# Altium schematic sheet Peripheral.SchDoc
size A3
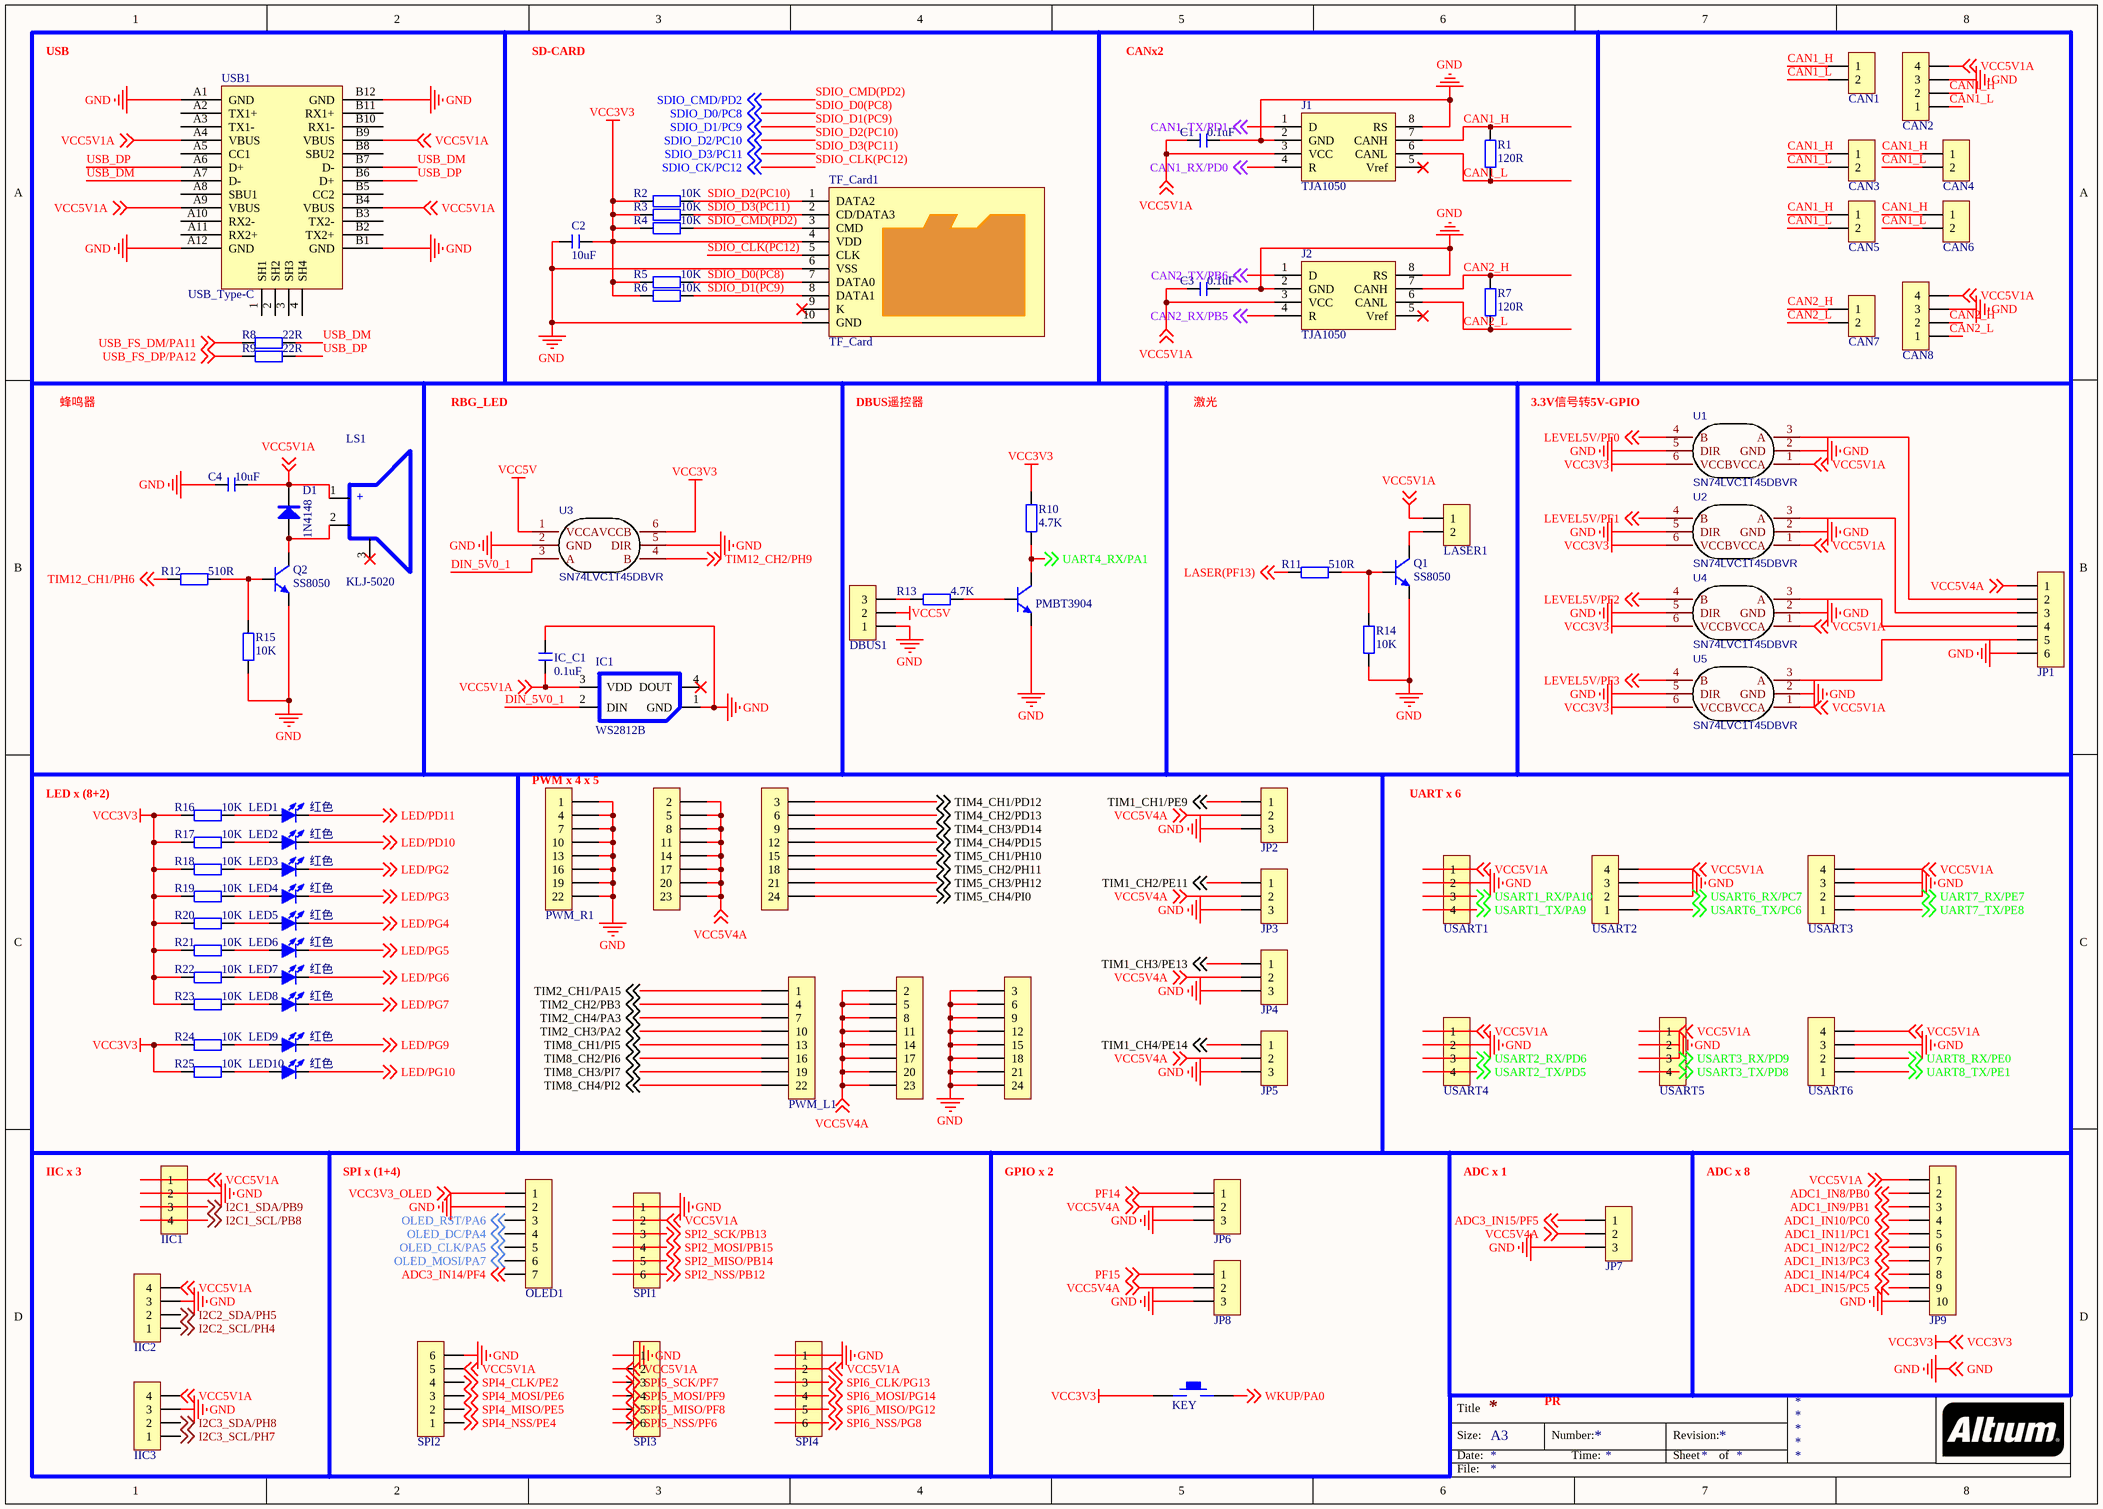
[diagram p0: Peripheral.SchDoc]

## Parts
C1  0.1uF  [C 0402_L]
C2  10uF  [C 0402_L]
C3  0.1uF  [C 0402_L]
C4  10uF  [C 0402_L]
CAN1  HDR-1X2  [MX 1.25-LS-2P]  (value not drawn)
CAN2  HDR-1X4  [MX 1.25-WS-4P]  (value not drawn)
CAN3  HDR-1X2  [MX 1.25-LS-2P]  (value not drawn)
CAN4  HDR-1X2  [MX 1.25-LS-2P]  (value not drawn)
CAN5  HDR-1X2  [MX 1.25-LS-2P]  (value not drawn)
CAN6  HDR-1X2  [MX 1.25-LS-2P]  (value not drawn)
CAN7  HDR-1X2  [MX 1.25-LS-2P]  (value not drawn)
CAN8  HDR-1X4  [MX 1.25-LS-4P]  (value not drawn)
D1  1N4148  [SOD-323]
DBUS1  HDR-1X3  [HDR2.54-WS-3P]  (value not drawn)
IC1  WS2812B  [LED 3528-4Pin]
IC_C1  0.1uF  [C 0402_L]
IIC1  HDR-1X4  [MX 1.25-WS-4P]  (value not drawn)
IIC2  HDR-1X4  [MX 1.25-LS-4P]  (value not drawn)
IIC3  HDR-1X4  [MX 1.25-LS-4P]  (value not drawn)
J1  TJA1050  [SOIC-8_150mil]
J2  TJA1050  [SOIC-8_150mil]
JP1  HDR-1X6  [MX 1.25-LS-6P]  (value not drawn)
JP2  HDR-1X3  [HDR2.54-LI-3P]  (value not drawn)
JP3  HDR-1X3  [HDR2.54-LI-3P]  (value not drawn)
JP4  HDR-1X3  [HDR2.54-LI-3P]  (value not drawn)
JP5  HDR-1X3  [HDR2.54-LI-3P]  (value not drawn)
JP6  HDR-1X3  [HDR2.54-LI-3P]  (value not drawn)
JP7  HDR-1X3  [MX 1.25-WS-3P]  (value not drawn)
JP8  HDR-1X3  [HDR2.54-LI-3P]  (value not drawn)
JP9  HDR-1X10  [MX 1.25-LS-10P]  (value not drawn)
LASER1  HDR-1X2  [MX 1.25-LS-2P]  (value not drawn)
LED1  红色  [LED 0805G]
LED2  红色  [LED 0805G]
LED3  红色  [LED 0805G]
LED4  红色  [LED 0805G]
LED5  红色  [LED 0805G]
LED6  红色  [LED 0805G]
LED7  红色  [LED 0805G]
LED8  红色  [LED 0805G]
LED9  红色  [LED 0805R]
LED10  红色  [LED 0805R]
LS1  KLJ-5020  [BUZ-SMD_4P-L5.0-W5.0-P3.80-TL]
OLED1  HDR-1X7  [MX 1.25-WS-7P]  (value not drawn)
PWM_L1  HDR3*8-left  [PIN-3*8-2.54 - duplicate]  (value not drawn)
PWM_R1  HDR3*8-right  [PIN-3*8-2.54 - duplicate]  (value not drawn)
Q1  SS8050  [SOT23-3L]
Q2  SS8050  [SOT23-3L]
Q3  PMBT3904  [SOT-23-3]
R1  120R  [R 0402_L]
R2  10K  [R 0402_L]
R3  10K  [R 0402_L]
R4  10K  [R 0402_L]
R5  10K  [R 0402_L]
R6  10K  [R 0402_L]
R7  120R  [R 0402_L]
R8  22R  [R 0402_L]
R9  22R  [R 0402_L]
R10  4.7K  [R 0402_L]
R11  510R  [R 0402_L]
R12  510R  [R 0402_L]
R13  4.7K  [R 0402_L]
R14  10K  [R 0402_L]
R15  10K  [R 0402_L]
R16  10K  [R 0402_L]
R17  10K  [R 0402_L]
R18  10K  [R 0402_L]
R19  10K  [R 0402_L]
R20  10K  [R 0402_L]
R21  10K  [R 0402_L]
R22  10K  [R 0402_L]
R23  10K  [R 0402_L]
R24  10K  [R 0402_L]
R25  10K  [R 0402_L]
RST1  KEY  [SMD-3.2*4.2]
SPI1  HDR-1X6  [MX 1.25-WS-6P]  (value not drawn)
SPI2  HDR-1X6  [MX 1.25-LS-6P]  (value not drawn)
SPI3  HDR-1X6  [MX 1.25-WS-6P]  (value not drawn)
SPI4  HDR-1X6  [MX 1.25-WS-6P]  (value not drawn)
TF_Card1  TF_Card  [Micro SD]
U1  SN74LVC1T45DBVR  [SOT-23-6_L2.9-W1.6-P0.95-LS2.8-BL]
U2  SN74LVC1T45DBVR  [SOT-23-6_L2.9-W1.6-P0.95-LS2.8-BL]
U3  SN74LVC1T45DBVR  [SOT-23-6_L2.9-W1.6-P0.95-LS2.8-BL]
U4  SN74LVC1T45DBVR  [SOT-23-6_L2.9-W1.6-P0.95-LS2.8-BL]
U5  SN74LVC1T45DBVR  [SOT-23-6_L2.9-W1.6-P0.95-LS2.8-BL]
USART1  HDR-1X4  [MX 1.25-LS-4P]  (value not drawn)
USART2  HDR-1X4  [MX 1.25-WS-4P]  (value not drawn)
USART3  HDR-1X4  [MX 1.25-WS-4P]  (value not drawn)
USART4  HDR-1X4  [MX 1.25-LS-4P]  (value not drawn)
USART5  HDR-1X4  [MX 1.25-LS-4P]  (value not drawn)
USART6  HDR-1X4  [MX 1.25-WS-4P]  (value not drawn)
USB1  USB_Type-C  [Type-C-TOP]

## Nets
GND: C1.1 C2.1 C3.1 C4.2 CAN2.3 CAN8.3 DBUS1.1 IC1.1(GND) IC_C1.1 IIC1.2 IIC2.3 IIC3.3 J1.2(GND) J1.8(RS) J2.2(GND) J2.8(RS) JP1.6 JP2.3 JP3.3 JP4.3 JP5.3 JP6.3 JP7.3 JP8.3 JP9.10 OLED1.2 PWM_L1.3 PWM_L1.6 PWM_L1.9 PWM_L1.12 PWM_L1.15 PWM_L1.18 PWM_L1.21 PWM_L1.24 PWM_R1.1 PWM_R1.4 PWM_R1.7 PWM_R1.10 PWM_R1.13 PWM_R1.16 PWM_R1.19 PWM_R1.22 Q1.2(E) Q2.2(E) Q3.2(E) R14.1 R15.1 SPI1.1 SPI2.6 SPI3.1 SPI4.1 TF_Card1.6(VSS) TF_Card1.10(GND) U1.2(GND) U1.5(DIR) U2.2(GND) U2.5(DIR) U3.2(GND) U3.5(DIR) U4.2(GND) U4.5(DIR) U5.2(GND) U5.5(DIR) USART1.2 USART2.3 USART3.3 USART4.2 USART5.2 USART6.3 USB1.A1(GND) USB1.A12(GND) USB1.B1(GND) USB1.B12(GND) ; off-sheet GND
VCC3V3: C2.2 R2.1 R3.1 R4.1 R5.1 R6.1 R10.2 R16.1 R17.1 R18.1 R19.1 R20.1 R21.1 R22.1 R23.1 R24.1 R25.1 RST1.1 TF_Card1.4(VDD) U1.6(VCCB) U2.6(VCCB) U3.6(VCCB) U4.6(VCCB) U5.6(VCCB) ; off-sheet VCC3V3
VCC5V: DBUS1.2 U3.1(VCCA)
ADC1_IN8/PB0: JP9.2 ; off-sheet ADC1_IN8/PB0
ADC1_IN9/PB1: JP9.3 ; off-sheet ADC1_IN9/PB1
ADC1_IN10/PC0: JP9.4 ; off-sheet ADC1_IN10/PC0
ADC1_IN11/PC1: JP9.5 ; off-sheet ADC1_IN11/PC1
ADC1_IN12/PC2: JP9.6 ; off-sheet ADC1_IN12/PC2
ADC1_IN13/PC3: JP9.7 ; off-sheet ADC1_IN13/PC3
ADC1_IN14/PC4: JP9.8 ; off-sheet ADC1_IN14/PC4
ADC1_IN15/PC5: JP9.9 ; off-sheet ADC1_IN15/PC5
ADC3_IN14/PF4: OLED1.7 ; off-sheet ADC3_IN14/PF4
ADC3_IN15/PF5: JP7.1 ; off-sheet ADC3_IN15/PF5
CAN1_H: CAN1.1 CAN2.2 CAN3.1 CAN4.1 CAN5.1 CAN6.1 J1.7(CANH) R1.2
CAN1_L: CAN1.2 CAN2.1 CAN3.2 CAN4.2 CAN5.2 CAN6.2 J1.6(CANL) R1.1
CAN1_RX/PD0: J1.4(R) ; off-sheet CAN1_RX/PD0
CAN1_TX/PD1: J1.1(D) ; off-sheet CAN1_TX/PD1
CAN2_H: CAN7.1 CAN8.2 J2.7(CANH) R7.2
CAN2_L: CAN7.2 CAN8.1 J2.6(CANL) R7.1
CAN2_RX/PB5: J2.4(R) ; off-sheet CAN2_RX/PB5
CAN2_TX/PB6: J2.1(D) ; off-sheet CAN2_TX/PB6
DIN_5V0_1: IC1.2(DIN) U3.3(A)
I2C1_SCL/PB8: IIC1.4 ; off-sheet I2C1_SCL/PB8
I2C1_SDA/PB9: IIC1.3 ; off-sheet I2C1_SDA/PB9
I2C2_SCL/PH4: IIC2.1 ; off-sheet I2C2_SCL/PH4
I2C2_SDA/PH5: IIC2.2 ; off-sheet I2C2_SDA/PH5
I2C3_SCL/PH7: IIC3.1 ; off-sheet I2C3_SCL/PH7
I2C3_SDA/PH8: IIC3.2 ; off-sheet I2C3_SDA/PH8
LASER(PF13): R11.1 ; off-sheet LASER(PF13)
LED/PD10: LED2.2(K) ; off-sheet LED/PD10
LED/PD11: LED1.2(K) ; off-sheet LED/PD11
LED/PG2: LED3.2(K) ; off-sheet LED/PG2
LED/PG3: LED4.2(K) ; off-sheet LED/PG3
LED/PG4: LED5.2(K) ; off-sheet LED/PG4
LED/PG5: LED6.2(K) ; off-sheet LED/PG5
LED/PG6: LED7.2(K) ; off-sheet LED/PG6
LED/PG7: LED8.2(K) ; off-sheet LED/PG7
LED/PG9: LED9.2(K) ; off-sheet LED/PG9
LED/PG10: LED10.2(K) ; off-sheet LED/PG10
LEVEL5V/PF0: U1.4(B) ; off-sheet LEVEL5V/PF0
LEVEL5V/PF1: U2.4(B) ; off-sheet LEVEL5V/PF1
LEVEL5V/PF2: U4.4(B) ; off-sheet LEVEL5V/PF2
LEVEL5V/PF3: U5.4(B) ; off-sheet LEVEL5V/PF3
OLED_CLK/PA5: OLED1.5 ; off-sheet OLED_CLK/PA5
OLED_DC/PA4: OLED1.4 ; off-sheet OLED_DC/PA4
OLED_MOSI/PA7: OLED1.6 ; off-sheet OLED_MOSI/PA7
OLED_RST/PA6: OLED1.3 ; off-sheet OLED_RST/PA6
PF14: JP6.1 ; off-sheet PF14
PF15: JP8.1 ; off-sheet PF15
SDIO_CLK(PC12): TF_Card1.5(CLK) ; off-sheet SDIO_CK/PC12  [also labelled SDIO_CK/PC12]
SDIO_CMD(PD2): R4.2 TF_Card1.3(CMD) ; off-sheet SDIO_CMD/PD2  [also labelled SDIO_CMD/PD2]
SDIO_D0(PC8): R5.2 TF_Card1.7(DATA0) ; off-sheet SDIO_D0/PC8  [also labelled SDIO_D0/PC8]
SDIO_D1(PC9): R6.2 TF_Card1.8(DATA1) ; off-sheet SDIO_D1/PC9  [also labelled SDIO_D1/PC9]
SDIO_D2(PC10): R2.2 TF_Card1.1(DATA2) ; off-sheet SDIO_D2/PC10  [also labelled SDIO_D2/PC10]
SDIO_D3(PC11): R3.2 TF_Card1.2(CD/DATA3) ; off-sheet SDIO_D3/PC11  [also labelled SDIO_D3/PC11]
SPI2_MISO/PB14: SPI1.5 ; off-sheet SPI2_MISO/PB14
SPI2_MOSI/PB15: SPI1.4 ; off-sheet SPI2_MOSI/PB15
SPI2_NSS/PB12: SPI1.6 ; off-sheet SPI2_NSS/PB12
SPI2_SCK/PB13: SPI1.3 ; off-sheet SPI2_SCK/PB13
SPI4_CLK/PE2: SPI2.4 ; off-sheet SPI4_CLK/PE2
SPI4_MISO/PE5: SPI2.2 ; off-sheet SPI4_MISO/PE5
SPI4_MOSI/PE6: SPI2.3 ; off-sheet SPI4_MOSI/PE6
SPI4_NSS/PE4: SPI2.1 ; off-sheet SPI4_NSS/PE4
SPI5_MISO/PF8: SPI3.5 ; off-sheet SPI5_MISO/PF8
SPI5_MOSI/PF9: SPI3.4 ; off-sheet SPI5_MOSI/PF9
SPI5_NSS/PF6: SPI3.6 ; off-sheet SPI5_NSS/PF6
SPI5_SCK/PF7: SPI3.3 ; off-sheet SPI5_SCK/PF7
SPI6_CLK/PG13: SPI4.3 ; off-sheet SPI6_CLK/PG13
SPI6_MISO/PG12: SPI4.5 ; off-sheet SPI6_MISO/PG12
SPI6_MOSI/PG14: SPI4.4 ; off-sheet SPI6_MOSI/PG14
SPI6_NSS/PG8: SPI4.6 ; off-sheet SPI6_NSS/PG8
TIM1_CH1/PE9: JP2.1 ; off-sheet TIM1_CH1/PE9
TIM1_CH2/PE11: JP3.1 ; off-sheet TIM1_CH2/PE11
TIM1_CH3/PE13: JP4.1 ; off-sheet TIM1_CH3/PE13
TIM1_CH4/PE14: JP5.1 ; off-sheet TIM1_CH4/PE14
TIM2_CH1/PA15: PWM_L1.1 ; off-sheet TIM2_CH1/PA15
TIM2_CH2/PB3: PWM_L1.4 ; off-sheet TIM2_CH2/PB3
TIM2_CH3/PA2: PWM_L1.10 ; off-sheet TIM2_CH3/PA2
TIM2_CH4/PA3: PWM_L1.7 ; off-sheet TIM2_CH4/PA3
TIM4_CH1/PD12: PWM_R1.3 ; off-sheet TIM4_CH1/PD12
TIM4_CH2/PD13: PWM_R1.6 ; off-sheet TIM4_CH2/PD13
TIM4_CH3/PD14: PWM_R1.9 ; off-sheet TIM4_CH3/PD14
TIM4_CH4/PD15: PWM_R1.12 ; off-sheet TIM4_CH4/PD15
TIM5_CH1/PH10: PWM_R1.15 ; off-sheet TIM5_CH1/PH10
TIM5_CH2/PH11: PWM_R1.18 ; off-sheet TIM5_CH2/PH11
TIM5_CH3/PH12: PWM_R1.21 ; off-sheet TIM5_CH3/PH12
TIM5_CH4/PI0: PWM_R1.24 ; off-sheet TIM5_CH4/PI0
TIM8_CH1/PI5: PWM_L1.13 ; off-sheet TIM8_CH1/PI5
TIM8_CH2/PI6: PWM_L1.16 ; off-sheet TIM8_CH2/PI6
TIM8_CH3/PI7: PWM_L1.19 ; off-sheet TIM8_CH3/PI7
TIM8_CH4/PI2: PWM_L1.22 ; off-sheet TIM8_CH4/PI2
TIM12_CH1/PH6: R12.1 ; off-sheet TIM12_CH1/PH6
TIM12_CH2/PH9: U3.4(B) ; off-sheet TIM12_CH2/PH9
UART4_RX/PA1: Q3.3(C) R10.1 ; off-sheet UART4_RX/PA1
UART7_RX/PE7: USART3.2 ; off-sheet UART7_RX/PE7
UART7_TX/PE8: USART3.1 ; off-sheet UART7_TX/PE8
UART8_RX/PE0: USART6.2 ; off-sheet UART8_RX/PE0
UART8_TX/PE1: USART6.1 ; off-sheet UART8_TX/PE1
USART1_RX/PA10: USART1.3 ; off-sheet USART1_RX/PA10
USART1_TX/PA9: USART1.4 ; off-sheet USART1_TX/PA9
USART2_RX/PD6: USART4.3 ; off-sheet USART2_RX/PD6
USART2_TX/PD5: USART4.4 ; off-sheet USART2_TX/PD5
USART3_RX/PD9: USART5.3 ; off-sheet USART3_RX/PD9
USART3_TX/PD8: USART5.4 ; off-sheet USART3_TX/PD8
USART6_RX/PC7: USART2.2 ; off-sheet USART6_RX/PC7
USART6_TX/PC6: USART2.1 ; off-sheet USART6_TX/PC6
USB_DM: R8.2 USB1.A7(D-) USB1.B7(D-)
USB_DP: R9.2 USB1.A6(D+) USB1.B6(D+)
USB_FS_DM/PA11: R8.1 ; off-sheet USB_FS_DM/PA11
USB_FS_DP/PA12: R9.1 ; off-sheet USB_FS_DP/PA12
VCC3V3_OLED: OLED1.1 ; off-sheet VCC3V3_OLED
VCC5V1A: C1.2 C3.2 C4.1 CAN2.4 CAN8.4 D1.2(K) IC1.3(VDD) IC_C1.2 IIC1.1 IIC2.4 IIC3.4 J1.3(VCC) J2.3(VCC) JP9.1 LASER1.1 LS1.1 SPI1.2 SPI2.5 SPI3.2 SPI4.2 U1.1(VCCA) U2.1(VCCA) U4.1(VCCA) U5.1(VCCA) USART1.1 USART2.4 USART3.4 USART4.1 USART5.1 USART6.4 USB1.A4(VBUS) USB1.A9(VBUS) USB1.B4(VBUS) USB1.B9(VBUS) ; off-sheet VCC5V1A
VCC5V4A: JP1.1 JP2.2 JP3.2 JP4.2 JP5.2 JP6.2 JP7.2 JP8.2 PWM_L1.2 PWM_L1.5 PWM_L1.8 PWM_L1.11 PWM_L1.14 PWM_L1.17 PWM_L1.20 PWM_L1.23 PWM_R1.2 PWM_R1.5 PWM_R1.8 PWM_R1.11 PWM_R1.14 PWM_R1.17 PWM_R1.20 PWM_R1.23 ; off-sheet VCC5V4A
WKUP/PA0: RST1.2 ; off-sheet WKUP/PA0
NetD1_1: D1.1(A) LS1.2 Q2.3(C)
NetDBUS1_3: DBUS1.3 R13.2
NetJP1_2: JP1.2 U1.3(A)
NetJP1_3: JP1.3 U2.3(A)
NetJP1_4: JP1.4 U4.3(A)
NetJP1_5: JP1.5 U5.3(A)
NetLASER1_2: LASER1.2 Q1.3(C)
NetLED1_1: LED1.1(A) R16.2
NetLED2_1: LED2.1(A) R17.2
NetLED3_1: LED3.1(A) R18.2
NetLED4_1: LED4.1(A) R19.2
NetLED5_1: LED5.1(A) R20.2
NetLED6_1: LED6.1(A) R21.2
NetLED7_1: LED7.1(A) R22.2
NetLED8_1: LED8.1(A) R23.2
NetLED9_1: LED9.1(A) R24.2
NetLED10_1: LED10.1(A) R25.2
NetQ1_1: Q1.1(B) R11.2 R14.2
NetQ2_1: Q2.1(B) R12.2 R15.2
NetQ3_1: Q3.1(B) R13.1

Not connected (* = marked no-connect by the designer): IC1 4(DOUT)*; J1 5(Vref)*; J2 5(Vref)*; LS1 3*; TF_Card1 9(K)*; USB1 1(SH1) 2(SH2) 3(SH3) 4(SH4) A2(TX1+) A3(TX1-) A5(CC1) A8(SBU1) A10(RX2-) A11(RX2+) B2(TX2+) B3(TX2-) B5(CC2) B8(SBU2) B10(RX1-) B11(RX1+)

## Notes on the sheet
- USB
- SD-CARD
- CANx2
- 蜂鸣器
- RBG_LED
- DBUS遥控器
- 激光
- 3.3V信号转5V-GPIO
- (near PWM_R1) PWM x 4 x 5
- LED x (8+2)
- UART x 6
- IIC x 3
- SPI x (1+4)
- GPIO x 2
- ADC x 1
- ADC x 8
- PR
- Title
- Size:
- Date:
- A3
- Number:
- Time:
- Revision:
- Sheet
- of
- File:
- (in symbol KLJ-5020) +

## Library data of the parts
C1-C4 IC_C1 = C: 贴片电容
CAN1 CAN3-CAN7 LASER1 = Header 2: 2P接插件
CAN2 CAN8 IIC1-IIC3 USART1-USART6 = Header 4: 4P接插件
D1 = 1N4148: 开关二极管
DBUS1 JP2-JP8 = Header 3: 3P接插件
J1 J2 = TJA1050: CAN芯片
JP1 SPI1-SPI4 = Header 6: 6P接插件
JP9 = Header 10: 10P接插件
LED1-LED10 = LED-SMD: 贴片LED
LS1 = KLJ-5020: 蜂鸣器
OLED1 = Header 7: 7P接插件
PWM_L1 = HDR3*8-left: Connector
PWM_R1 = HDR3*8-right: Connector
Q1 Q2 = 8050-SMD: 高频放大-NPN型
Q3 = PMBT3904: NPN Bipolar Transistor
R1-R25 = R: 贴片电阻
RST1 = KEY_M
TF_Card1 = TF_Card: TF卡座
U1-U5 = SN74LVC1T45DBVR: BOM_Manufacturer: TI; BOM_Paste Type: recommend; BOM_Assembly Type: smtWeld; BOM_Supplier: LCSC; BOM_Manufacturer Part: SN74LVC1T45DBVR; image: //image.lceda.cn/szlcsc/C7843.jpg; BOM_Supplier Part: C7843; spicePre: U; spiceSymbolName: SN74LVC1T45DBVR